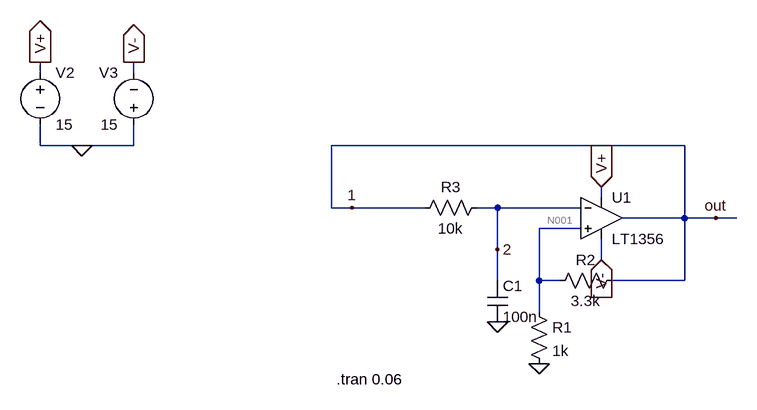
[diagram p0: schematic Astable Multivibrator.asc]
Astable Multivibrator.asc, the LTspice schematic file:
Version 4
SHEET 1 880 680
WIRE -624 -64 -624 -80
WIRE -480 -64 -480 -80
WIRE -624 48 -624 16
WIRE -560 48 -624 48
WIRE -480 48 -480 16
WIRE -480 48 -560 48
WIRE 368 48 -176 48
WIRE 240 128 240 112
WIRE -176 144 -176 48
WIRE -144 144 -176 144
WIRE -32 144 -144 144
WIRE 80 144 48 144
WIRE 208 144 80 144
WIRE 368 160 368 48
WIRE 368 160 272 160
WIRE 416 160 368 160
WIRE 448 160 416 160
WIRE 208 176 144 176
WIRE 80 208 80 144
WIRE 240 224 240 192
WIRE 80 256 80 208
WIRE 144 256 144 176
WIRE 176 256 144 256
WIRE 368 256 368 160
WIRE 368 256 256 256
WIRE 144 304 144 256
FLAG 144 384 0
FLAG 80 320 0
FLAG -560 48 0
FLAG -624 -80 V+
IOPIN -624 -80 Out
FLAG -480 -80 V-
IOPIN -480 -80 Out
FLAG 240 112 V+
IOPIN 240 112 In
FLAG 240 224 V-
IOPIN 240 224 In
FLAG 416 160 out
FLAG -144 144 1
FLAG 80 208 2
SYMBOL OpAmps\\LT1356 240 96 R0
SYMATTR InstName U1
SYMBOL res 128 288 R0
SYMATTR InstName R1
SYMATTR Value 1k
SYMBOL res 272 240 R90
WINDOW 0 0 56 VBottom 2
WINDOW 3 32 56 VTop 2
SYMATTR InstName R2
SYMATTR Value 3.3k
SYMBOL res 64 128 R90
WINDOW 0 0 56 VBottom 2
WINDOW 3 32 56 VTop 2
SYMATTR InstName R3
SYMATTR Value 10k
SYMBOL cap 64 256 R0
SYMATTR InstName C1
SYMATTR Value 100n
SYMBOL voltage -624 -80 R0
WINDOW 123 0 0 Left 0
WINDOW 39 0 0 Left 0
SYMATTR InstName V2
SYMATTR Value 15
SYMBOL voltage -480 32 R180
WINDOW 0 24 96 Left 2
WINDOW 3 24 16 Left 2
WINDOW 123 0 0 Left 0
WINDOW 39 0 0 Left 0
SYMATTR InstName V3
SYMATTR Value 15
TEXT -168 408 Left 2 !.tran 0.06

The netlist it stands for:
* Astable Multivibrator.asc
XU1 N001 2 V+ V- 1 LT1356  ; pins In+ In- V+ V- OUT
R1 N001 0 1k
R2 1 N001 3.3k
R3 2 1 10k
C1 2 0 100n
V2 V+ 0 15
V3 0 V- 15
.tran 0.06
.backanno
.end

* Results of the author's LTspice run, read from the files saved beside the schematic
* Operating Point, zero values left out:
*   V(2) = 163.6 µV
*   V(n001) = 163.6 µV
*   V(v+) = 15 V
*   V(1) = 969.6 µV
*   V(v-) = -15 V
*   I(R3) = -80.6 nA
*   I(R2) = 244.2 nA
*   I(R1) = 163.6 nA
*   I(V3) = -994.2 µA
*   I(V2) = -994.3 µA
*   Ix(u1:1) = 80.6 nA
*   Ix(u1:2) = 80.6 nA
*   Ix(u1:3) = 994.3 µA
*   Ix(u1:4) = -994.2 µA
*   Ix(u1:5) = -324.8 nA
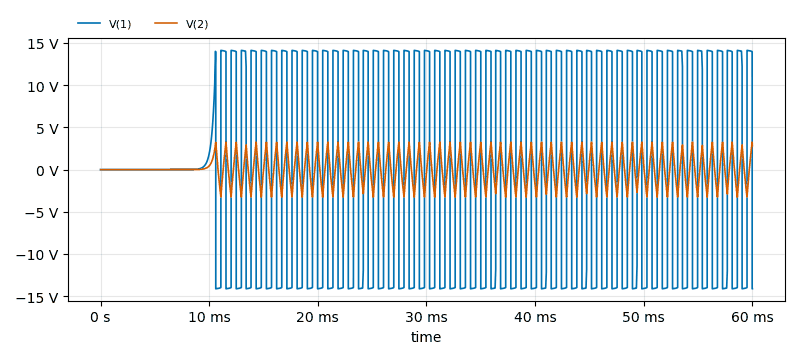
[diagram p1: Transient Analysis of Astable Multivibrator.asc, plotted from the saved traces]
* Transient Analysis, 1 run:
*   V(1): min -14.13 V, max 14.13 V, average 77.3 mV, rms 12.77 V, last -14.12 V
*   V(2): min -3.254 V, max 3.254 V, average 25.23 mV, rms 1.756 V, last 2.853 V